# EasyEDA schematic ServoControl.json
TITLE: Control servomotor cu Atmega16A-PU; REV: 1.0; Date: 2022-01-11; Sheet: 1/1; Company: UNITBV
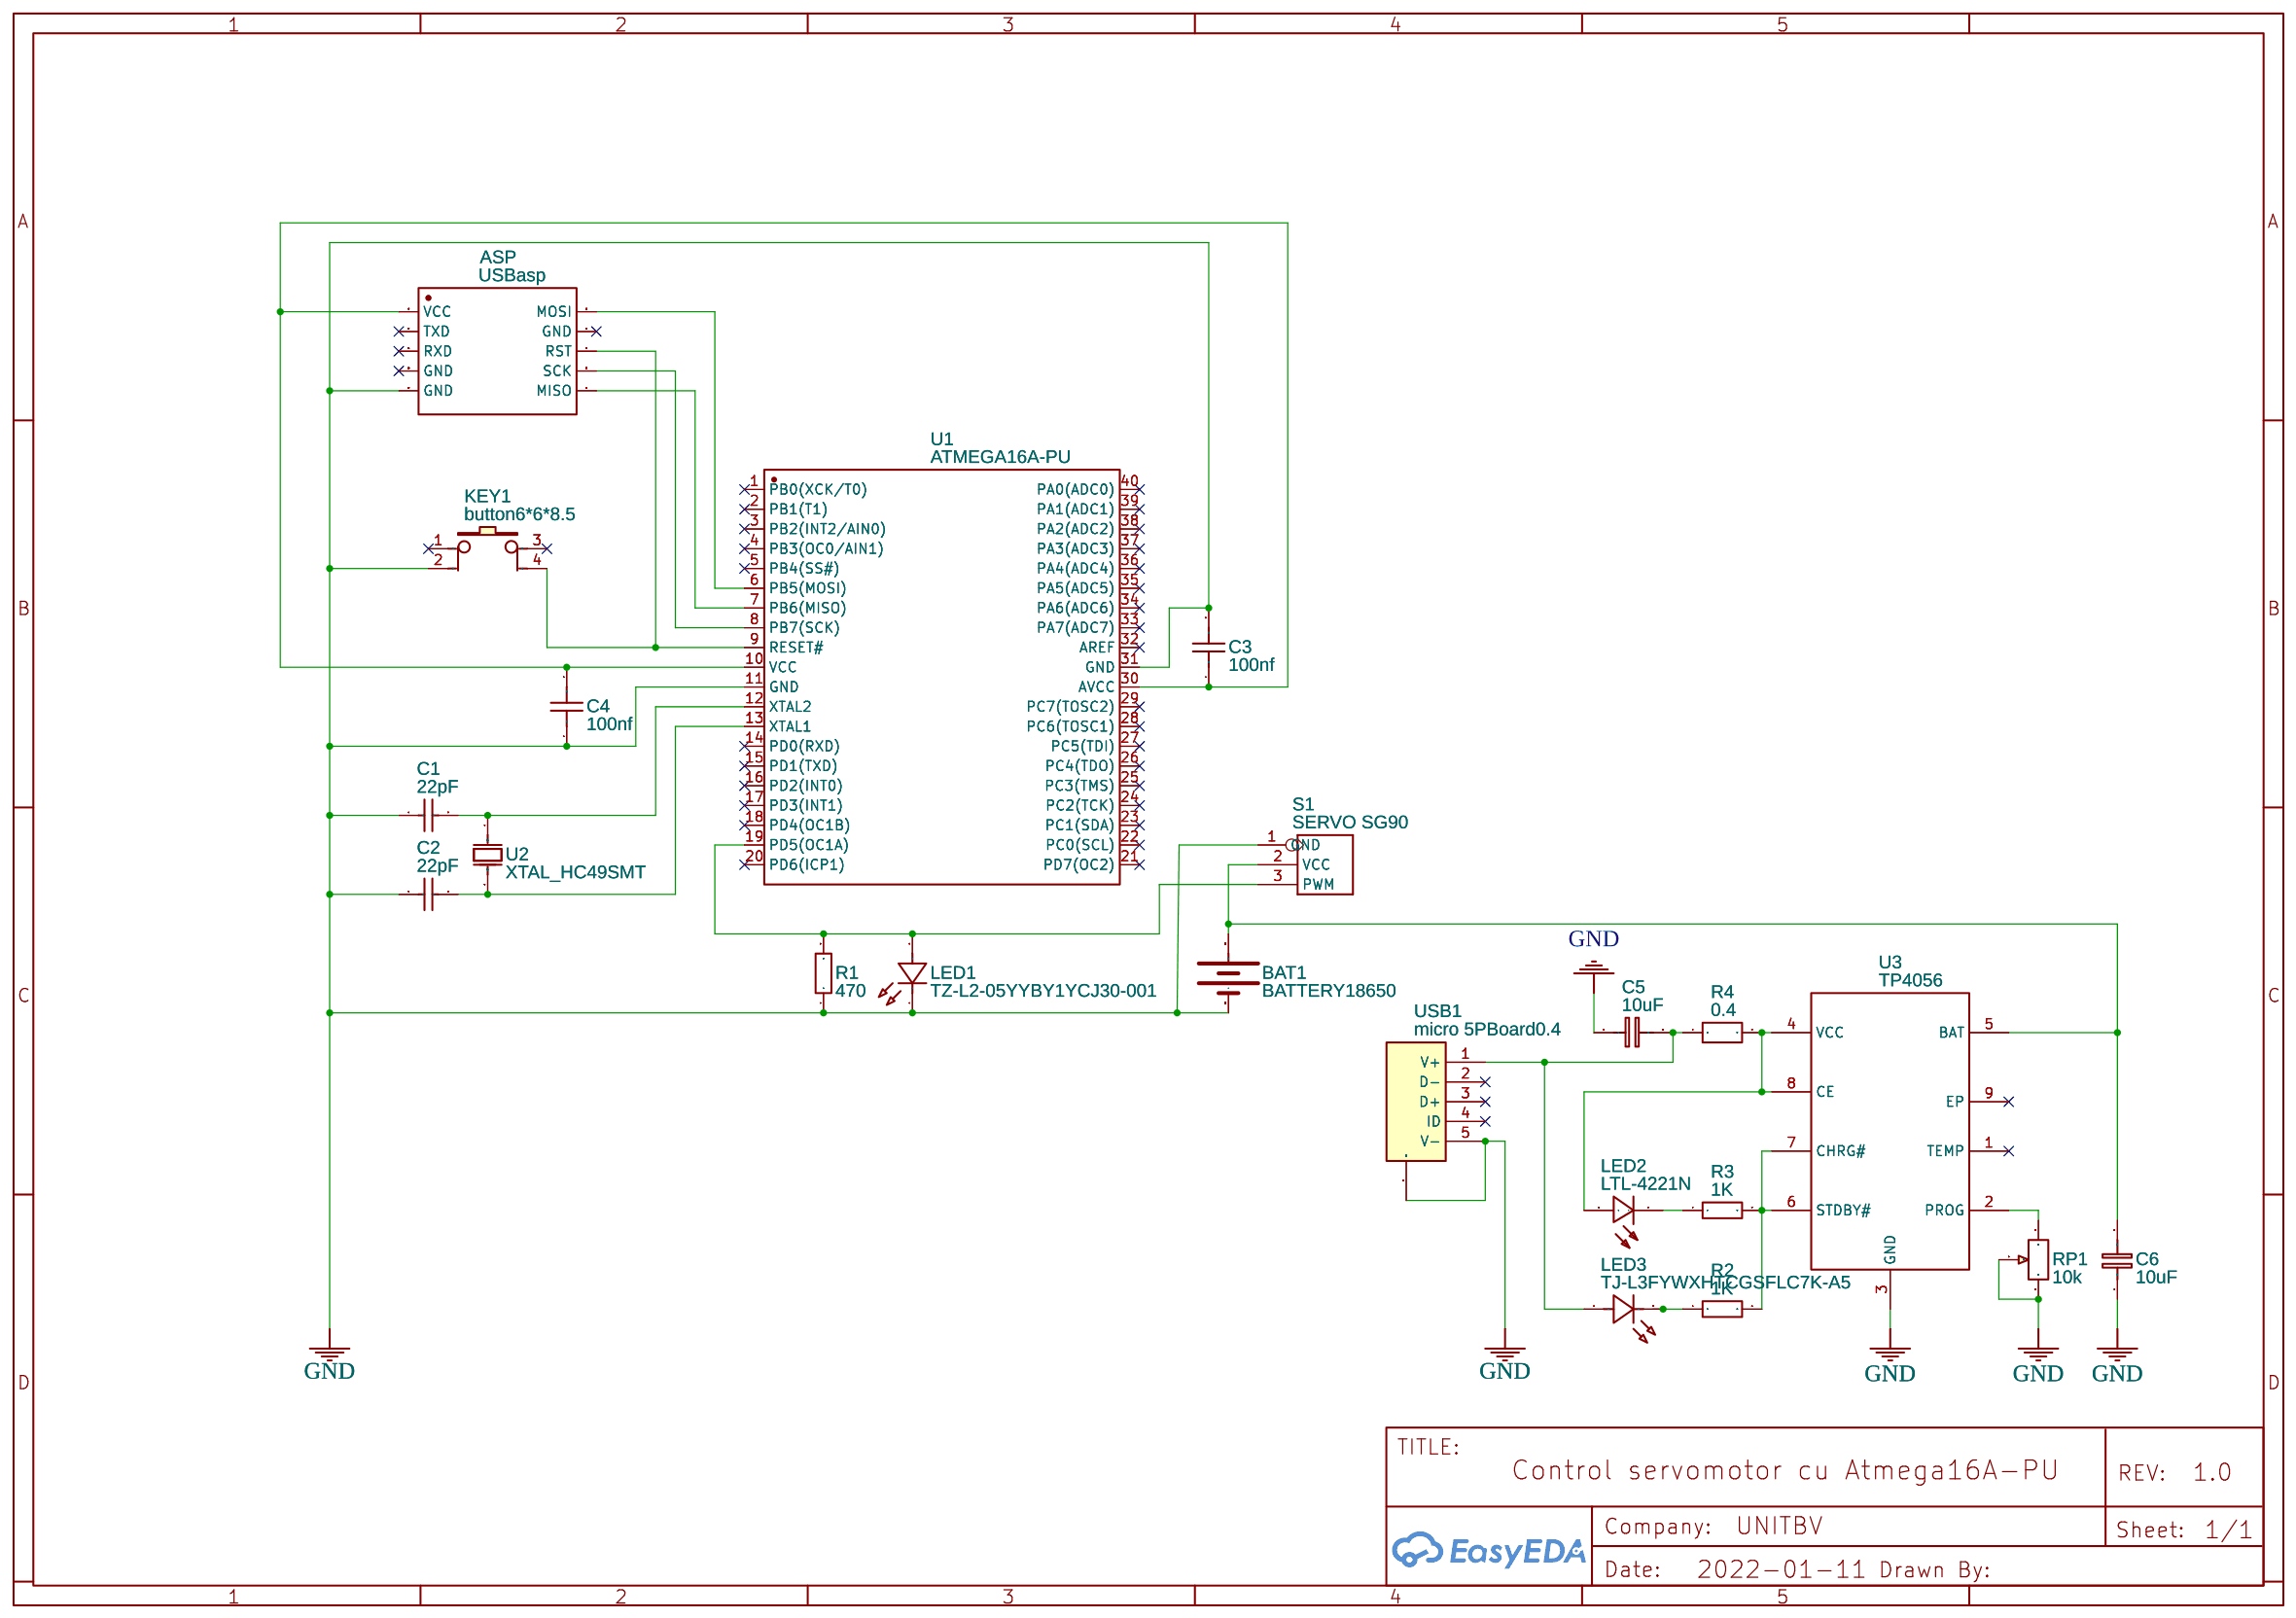
[diagram p0: schematic sheet]

## Parts
ASP  USBasp  [USBASP]
BAT1  BATTERY18650  [BATTERY_18650-HOLDER]
C1  22pF  [CAP-TH_L3.5-W3.0-P2.54-D0.8]
C2  22pF  [CAP-TH_L3.5-W3.0-P2.54-D0.8]
C3  100nf  [CERAMIC CAPACITOR 100NF 50V LEADED]
C4  100nf  [CERAMIC CAPACITOR 100NF 50V LEADED]
C5  10uF  [C0603]
C6  10uF  [C0603]
KEY1  button6*6*8.5  [KEY-TH_4P-L6.0-W6.0-P4.50]
LED1  TZ-L2-05YYBY1YCJ30-001  [LED-TH_BD5.9-P2.54-RD_YELLOW]
LED2  LTL-4221N  [LED-TH_BD3.0-P2.54-RD-RED]
LED3  TJ-L3FYWXHTCGSFLC7K-A5  [LED-TH_BD3.0-P2.54-D0.5-FD_GREEN]
R1  470  [RES-TH_BD4.5-L11.5-P15.50-D0.7]
R2  1K  [RES-TH_BD5.5-L15.0-P19.00-D0.8]
R3  1K  [RES-TH_BD5.5-L15.0-P19.00-D0.8]
R4  0.4  [R0603]
RP1  10k  [RES-ADJ-TH_3386P]
S1  SERVO SG90  [SERVO_SG90_TH]
U1  ATMEGA16A-PU  [DIP-40_L52.3-W13.9-P2.54-LS15.2-BL]
U2  XTAL_HC49SMT  [CRYSTAL-SMD_L11.4-W4.8-LS12.7]
U3  TP4056  [ESOP-8_L4.9-W3.9-P1.27-LS6.0-BL-EP]
USB1  micro 5PBoard0.4  [MICRO-USB-SMD_5P-P0.65-H-F_MICRO-USB-5P]

## Library data of the parts
ASP = USBasp: Contributor: e.bahatama
BAT1 = BATTERY18650: Battery Holders; Contributor: SparkFun
C1 C2 = 22pf/50V 10%: Supplier: LCSC; Manufacturer: ReliaPro; Supplier Part: C9316
C3 C4 = CERAMIC CAPACITOR 100NF 50V LEADED: Supplier: LCSC; Manufacturer: ReliaPro; Manufacturer Part: Ceramic capacitors47PF 3KV; Contributor: LCSC; Supplier Part: C19375
C5 C6 = C_0603_EU: Contributor: LCEDA_Lib
KEY1 = button6*6*8.5: Supplier Part: C59980; Supplier: LCSC; Manufacturer: ReliaPro
LED1 = TZ-L2-05YYBY1YCJ30-001: Supplier: LCSC; Supplier Part: C779441; Manufacturer: TUOZHAN; Contributor: LCSC
LED2 = LTL-4221N: Supplier: LCSC; Supplier Part: C125081; Manufacturer: Lite-On; Contributor: LCSC; JLCPCB Part Class: Extended Part
LED3 = TJ-L3FYWXHTCGSFLC7K-A5: Supplier: LCSC; Supplier Part: C331045; Manufacturer: TOGIALED; Contributor: LCSC; JLCPCB Part Class: Extended Part
R1 = MF1W-470Ω±1% T: Supplier: LCSC; Supplier Part: C119478; Manufacturer: Chian Chia Elec; Contributor: LCSC; JLCPCB Part Class: Extended Part
R2 R3 = EWWR0003J1K00T9: Supplier: LCSC; Supplier Part: C348856; Manufacturer: ResistorToday; Contributor: LCSC; JLCPCB Part Class: Extended Part
R4 = R_0603_EU: Contributor: LCEDA_Lib
RP1 = R_3386P_EU: Supplier: LCSC; Contributor: LCEDA_Lib; Value(Ω): 10K
S1 = SERVO SG90: Contributor: otanezlor
U1 = ATMEGA16A-PU: Supplier: LCSC; Manufacturer: MICROCHIP; Supplier Part: C30504; JLCPCB Part Class: Extended Part
U2 = XTAL_HC49SMT: Supplier: LCSC; Supplier Part: C9900001625; Manufacturer: null; JLCPCB Part Class: Extended Part; Contributor: LCSC
U3 = TP4056: Contributor: Guest; Supplier: LCSC; Manufacturer: TOPPOWER; Supplier Part: C16581; JLCPCB Part Class: Basic Part
USB1 = micro 5PBoard0.4No column lengthened0.75Plus welding feet: Supplier: LCSC; Manufacturer: ValuePro; Supplier Part: C40947; JLCPCB Part Class: Extended Part

## Nets
GND: ASP.GND1(GND) BAT1.GND@1(-) C1.1 C2.1 C3.2 C4.1 C5.1 C6.1 KEY1.2 LED1.1(-) R1.1 RP1.1 RP1.2 S1.1(GND) U1.11(GND) U1.31(GND) U3.3(GND) USB1.0(MTN6) USB1.5(V-)
Net-(ASP-MISO): ASP.MISO U1.7(PB6(MISO))
Net-(ASP-MOSI): ASP.MOSI U1.6(PB5(MOSI))
Net-(ASP-RST): ASP.RST KEY1.4 U1.9(RESET#)
Net-(ASP-SCK): ASP.SCK U1.8(PB7(SCK))
Net-(ASP-VCC): ASP.VCC C3.1 C4.2 U1.10(VCC) U1.30(AVCC)
Net-(BAT1-PWR@1): BAT1.PWR@1(+) C6.2 S1.2(VCC) U3.5(BAT)
Net-(C1-2): C1.2 U1.12(XTAL2) U2.1(OSC1)
Net-(C2-2): C2.2 U1.13(XTAL1) U2.2(OSC2)
Net-(C5-2): C5.2 LED3.1(+) R4.1 USB1.1(V+)
Net-(LED1-2): LED1.2(+) R1.2 S1.3(PWM) U1.19(PD5(OC1A))
Net-(LED2-1): LED2.1(-) R3.1
Net-(LED2-2): LED2.2(+) R4.2 U3.4(VCC) U3.8(CE)
Net-(LED3-2): LED3.2(-) R2.1
Net-(R2-2): R2.2 R3.2 U3.6(STDBY#) U3.7(CHRG#)
Net-(RP1-3): RP1.3 U3.2(PROG)

Not connected (* = marked no-connect by the designer): ASP GND2(GND)* GND3(GND)* RXD* TXD*; KEY1 1* 3*; U1 1(PB0(XCK/T0))* 2(PB1(T1))* 3(PB2(INT2/AIN0))* 4(PB3(OC0/AIN1))* 5(PB4(SS#))* 14(PD0(RXD))* 15(PD1(TXD))* 16(PD2(INT0))* 17(PD3(INT1))* 18(PD4(OC1B))* 20(PD6(ICP1))* 21(PD7(OC2))* 22(PC0(SCL))* 23(PC1(SDA))* 24(PC2(TCK))* 25(PC3(TMS))* 26(PC4(TDO))* 27(PC5(TDI))* 28(PC6(TOSC1))* 29(PC7(TOSC2))* 32(AREF)* 33(PA7(ADC7))* 34(PA6(ADC6))* 35(PA5(ADC5))* 36(PA4(ADC4))* 37(PA3(ADC3))* 38(PA2(ADC2))* 39(PA1(ADC1))* 40(PA0(ADC0))*; U3 1(TEMP)* 9(EP)*; USB1 2(D-)* 3(D+)* 4(ID)*
